# Altium project PCB_AD8349.PrjPcb
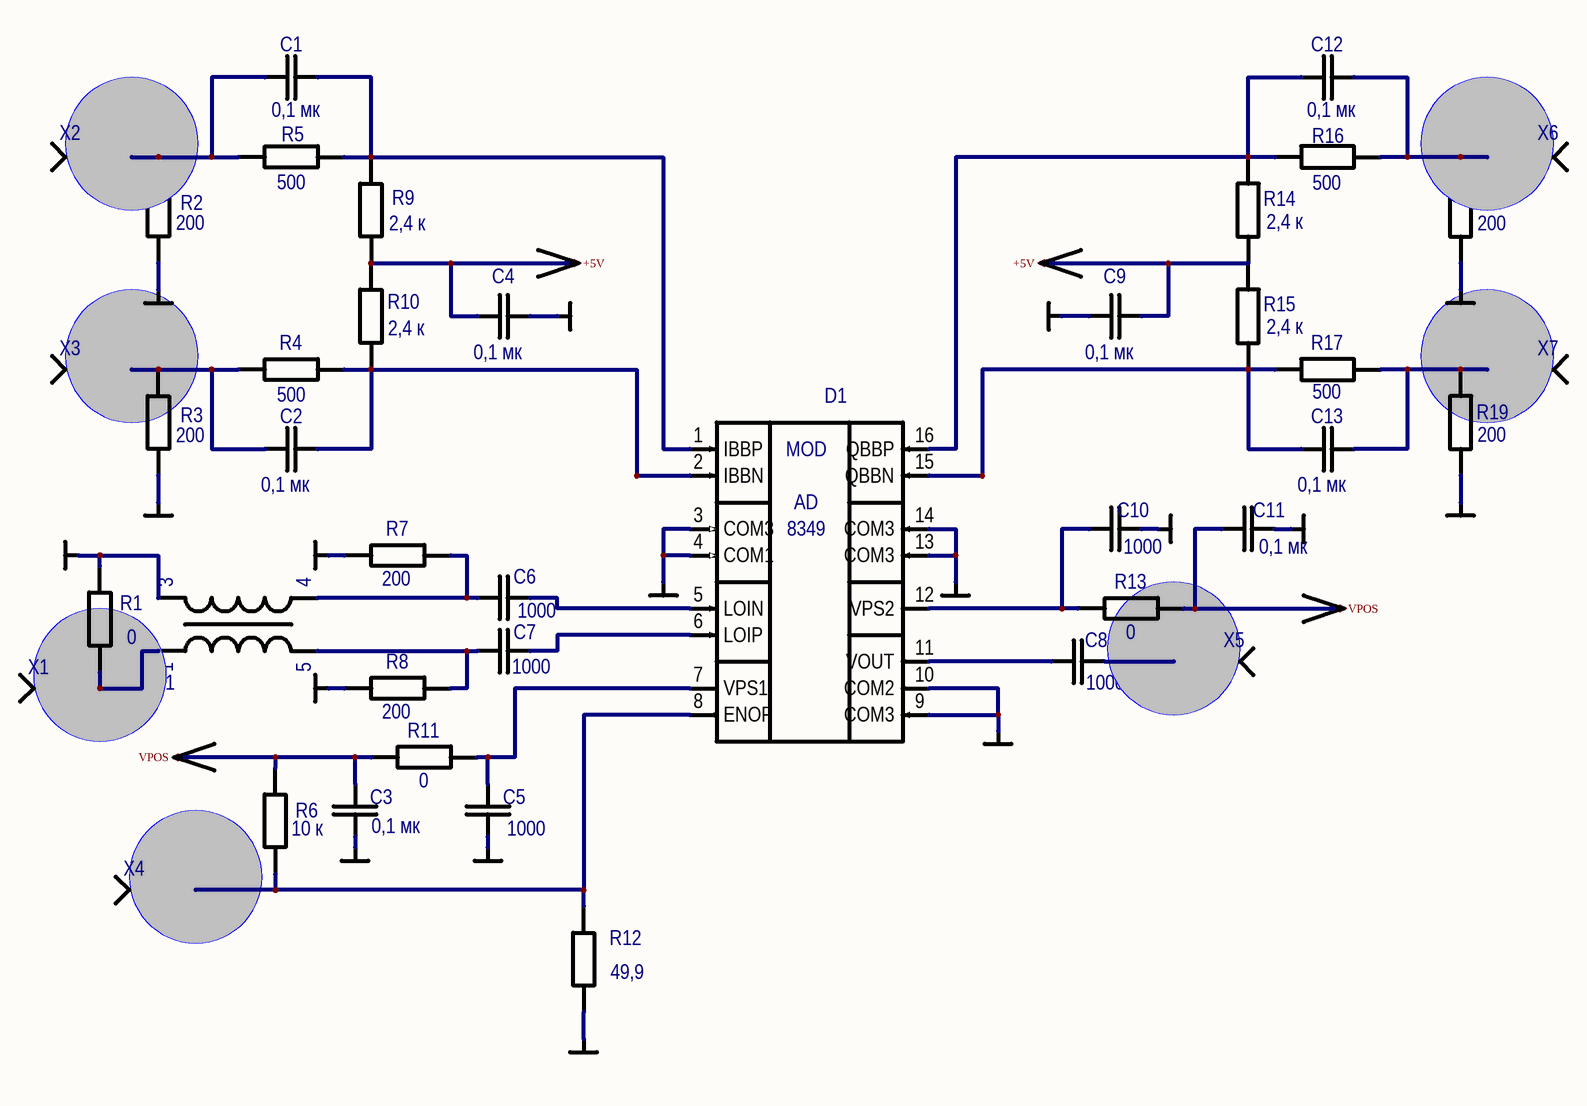
[diagram p0: AD8349.SchDoc]
1 sheet, 62 parts. Net scope: global (net labels, ports and power ports of the same name join across sheets).
Board file: AD8349.PcbDoc

## Sheet AD8349.SchDoc
size A1; SheetNumber: 1; SheetTotal: 1

### Parts
(Parts that share a designator on the sheet are numbered #1, #2 ... from top to bottom, then left to right.)
*#1  GND  (value not drawn)  (graphical)
*#2  GND  (value not drawn)  (graphical)
*#3  VCC  (value not drawn)  (graphical)
*#4  GND  (value not drawn)  (graphical)
*#5  GND  (value not drawn)  (graphical)
*#6  VCC  (value not drawn)  (graphical)
*#7  GND  (value not drawn)  (graphical)
*#8  GND  (value not drawn)  (graphical)
*#9  GND  (value not drawn)  (graphical)
*?#1  VCC  (value not drawn)  (graphical)
*?#2  VCC  (value not drawn)  (graphical)
*?#3  GND  (value not drawn)  (graphical)
*?#4  GND  (value not drawn)  (graphical)
*?#5  GND  (value not drawn)  (graphical)
*?#6  GND  (value not drawn)  (graphical)
*?#7  GND  (value not drawn)  (graphical)
*?#8  GND  (value not drawn)  (graphical)
*?#9  GND  (value not drawn)  (graphical)
*?#10  GND  (value not drawn)  (graphical)
*?#11  GND  (value not drawn)  (graphical)
*?#12  GND  (value not drawn)  (graphical)
C1  0,1 мк  [CAPC1005L]
C2  0,1 мк  [CAPC1005L]
C3  0,1 мк  [CAPC1005L]
C4  0,1 мк  [CAPC1005L]
C5  1000  [CAPC1005L]
C6  1000  [CAPC1005L]
C7  1000  [CAPC1005L]
C8  1000  [CAPC1005L]
C9  0,1 мк  [CAPC1005L]
C10  1000  [CAPC1005L]
C11  0,1 мк  [CAPC1005L]
C12  0,1 мк  [CAPC1005L]
C13  0,1 мк  [CAPC1005L]
D1  AD8349  [TSSOP65P490X110-RE-16-2]  (value not drawn)
R1  0  [RESC1005L]
R2  200  [RESC1005L]
R3  200  [RESC1005L]
R4  500  [RESC1005L]
R5  500  [RESC1005L]
R6  10 к  [RESC1005L]
R7  200  [RESC1005L]
R8  200  [RESC1005L]
R9  2,4 к  [RESC1005L]
R10  2,4 к  [RESC1005L]
R11  0  [RESC1005L]
R12  49,9  [RESC1608L]
R13  0  [RESC1005L]
R14  2,4 к  [RESC1005L]
R15  2,4 к  [RESC1005L]
R16  500  [RESC1005L]
R17  500  [RESC1005L]
R18  200  [RESC1005L]
R19  200  [RESC1005L]
T1  ETC1-1-13TR  [TRANS_ETC1-1-13TR]  (value not drawn)
X1  СРГ-50-751ФВ  [TP0.6X1]  (value not drawn)
X2  СРГ-50-751ФВ  [TP0.6X1]  (value not drawn)
X3  СРГ-50-751ФВ  [TP0.6X1]  (value not drawn)
X4  СРГ-50-751ФВ  [TP0.6X1]  (value not drawn)
X5  СРГ-50-751ФВ  [TP0.6X1]  (value not drawn)
X6  СРГ-50-751ФВ  [TP0.6X1]  (value not drawn)
X7  СРГ-50-751ФВ  [TP0.6X1]  (value not drawn)

### Nets
+5V: C4.2 C9.2 R9.1 R10.2 R14.1 R15.2
GND: C3.1 C4.1 C5.1 C9.1 C10.2 C11.2 D1.3(COM3) D1.4(COM1) D1.9(COM3) D1.10(COM2) D1.13(COM3) D1.14(COM3) R1.2 R2.1 R3.1 R7.1 R8.1 R12.1 R18.1 R19.1 T1.3
VPOS: C3.2 C11.1 R6.2 R11.1 R13.2
NetC1_1: C1.1 R2.2 R5.1 X2.1
NetC1_2: C1.2 D1.1(IBBP) R5.2 R9.2
NetC2_1: C2.1 R3.2 R4.1 X3.1
NetC2_2: C2.2 D1.2(IBBN) R4.2 R10.1
NetC5_2: C5.2 D1.7(VPS1) R11.2
NetC6_1: C6.1 R7.2 T1.4
NetC6_2: C6.2 D1.5(LOIN)
NetC7_1: C7.1 R8.2 T1.5
NetC7_2: C7.2 D1.6(LOIP)
NetC8_1: C8.1 D1.11(VOUT)
NetC8_2: C8.2 X5.1
NetC10_1: C10.1 D1.12(VPS2) R13.1
NetC12_1: C12.1 R16.1 R18.2 X6.1
NetC12_2: C12.2 D1.16(QBBP) R14.2 R16.2
NetC13_1: C13.1 R17.1 R19.2 X7.1
NetC13_2: C13.2 D1.15(QBBN) R15.1 R17.2
NetD1_8: D1.8(ENOP) R6.1 R12.2 X4.1
NetR1_1: R1.1 T1.1 X1.1

### Notes on the sheet
- Title
- Size:
- Date:
- File:
- A1
- Number:
- Time:
- Revision:
- Sheet
- of
- (in symbol AD8349) MOD; AD; 8349

### Library data of the parts
*#1 *#2 *#4 *#5 *#7-*#9 *?#3-*?#12 = GND: Корпус ЕСКД. Для "наложения" на штатный Power Bar
*#3 *#6 *?#1 *?#2 = VCC: Порт ЕСКД. Для "наложения" на штатный Power Bar
C1-C4 C9 C11-C13 = i6124B5A087044000001: Чип-конденсатор; ManufacturerPartNumber: 0402 X5R 0,1 мкФ ±10 % 10 В; Name: 0402; Power/Voltage: 10 В; TKE/TKC: {TKE/TKC}; Tolerance: ±10 %; PCADSymbol: C; PCADLibrary: PASSIV.LIB; BCPId: *; Manufacturer: *; Type: Конденсатор; Value: 0,1 мк; ImKey: i6124B5A087044000001; PCADType: C0402; PCADPattern: C0402
C5-C8 C10 = i6124B5A08727A000007: Чип-конденсатор; ManufacturerPartNumber: 0402 C0G 1000 пФ ±5 % 50 В; Name: 0402; Power/Voltage: 50 В; TKE/TKC: {TKE/TKC}; Tolerance: ±5 %; PCADSymbol: C; PCADLibrary: PASSIV.LIB; Rem: Использовать диэлектрик NP0; BCPId: *; Manufacturer: *; Type: Конденсатор; Value: 1000; ImKey: i6124B5A08727A000007; PCADType: C0402; PCADPattern: C0402
D1 = AD8349: WIDEBAND DIRECT QUADRATURE MODULATOR, 100 - 6000 MHz; Manufacturer: Hittite; Type: Микросхема; SymAuthor: Чернова Ю.Г.; Package: LP4E; ManufacturerPartNumber: AD8349
R1 R11 R13 = i6124B5A0876CB00001A: Чип-резистор; ManufacturerPartNumber: CR0402-J/-000GLF Bourns; Name: 0402; Tolerance: {Tolerance}; PCADSymbol: R; PCADLibrary: PASSIV.LIB; BCPId: *; Manufacturer: *; Type: Резистор; Value: 0; ImKey: i6124B5A0876CB00001A; PCADType: R0402; PCADPattern: R0402
R2 R3 R18 R19 = i6124B5A0870A6000002: Чип-резистор; ManufacturerPartNumber: Р1-12-0,062-200 Ом ±5 % - Т; Name: 0402; Tolerance: ±5 %; Power/Voltage: 0,062 Вт; TU/GOST: АЛЯР.434110.005 ТУ; BCPId: *; Manufacturer: *; Type: Резистор; Value: 200; ImKey: i6124B5A0870A6000002
R4 R5 R16 R17 = i6124B5A08765B000007: Чип-резистор; ManufacturerPartNumber: Р1-12-0,062-500 Ом ±1 % - Т; Name: 0402; Tolerance: ±1 %; Power/Voltage: 0,062 Вт; TU/GOST: АЛЯР.434110.005 ТУ; BCPId: *; Manufacturer: *; Type: Резистор; Value: 500; ImKey: i6124B5A08765B000007
R6 = i6124B5A0876CB000018: Чип-резистор; ManufacturerPartNumber: CR0402-JW-103GLF Bourns; Name: 0402; Tolerance: ±5 %; PCADSymbol: R; PCADLibrary: PASSIV.LIB; BCPId: *; Manufacturer: *; Type: Резистор; Value: 10 к; ImKey: i6124B5A0876CB000018; PCADType: R0402; PCADPattern: R0402
R7 R8 = i6124B5A0876CB000017: Чип-резистор; ManufacturerPartNumber: CR0402-JW-201GLF Bourns; Name: 0402; Tolerance: ±5 %; PCADSymbol: R; PCADLibrary: PASSIV.LIB; BCPId: *; Manufacturer: *; Type: Резистор; Value: 200; ImKey: i6124B5A0876CB000017; PCADType: R0402; PCADPattern: R0402
R9 R10 R14 R15 = i6124B5A0870A6000023: Чип-резистор; ManufacturerPartNumber: Р1-12-0,062-2,4 кОм ±5 % - Т; Name: 0402; Tolerance: ±5 %; Power/Voltage: 0,062 Вт; TU/GOST: АЛЯР.434110.005 ТУ; BCPId: *; Manufacturer: *; Type: Резистор; Value: 2,4 к; ImKey: i6124B5A0870A6000023
R12 = i6124B5A08741A00000E: Чип-резистор; ManufacturerPartNumber: Р1-12-0,1-49,9 Ом ±1 % - Т; Name: 0603; Tolerance: ±1 %; Power/Voltage: 0,1 Вт; TU/GOST: АЛЯР.434110.005 ТУ; BCPId: *; Manufacturer: *; Type: Резистор; Value: 49,9; ImKey: i6124B5A08741A00000E
T1 = ETC1-1-13TR: Трансформатор; Manufacturer*: Mini-Circuits; Power/Voltage*: 0.25Вт; BCPId: *; Type: Трансформатор; ManufacturerPartNumber: ETC1-1-13TR; Package: SM-22
X1-X7 = СРГ-50-751ФВ: Переход; TU/GOST: ВР0.364.049 ТУ; BCPId: *; Name: *; ManufacturerPartNumber: СРГ-50-751ФВ; Type: Переход